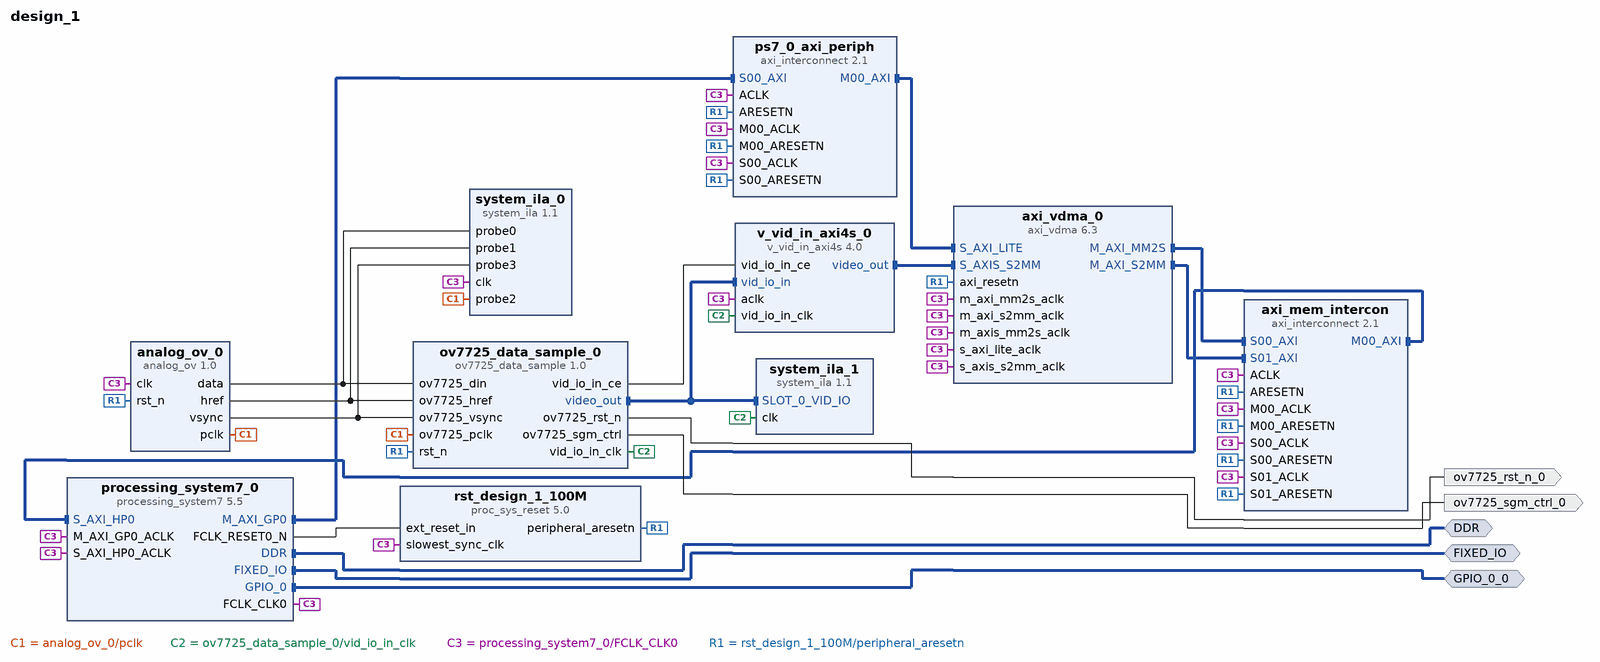
[diagram p0: block diagram of the top level]
# Vivado block design design_1, xc7z010clg400-1, Vivado 2021.1
create_bd_design design_1

create_bd_intf_port -mode Master -vlnv xilinx.com:interface:ddrx_rtl:1.0 DDR
create_bd_intf_port -mode Master -vlnv xilinx.com:display_processing_system7:fixedio_rtl:1.0 FIXED_IO
create_bd_intf_port -mode Master -vlnv xilinx.com:interface:gpio_rtl:1.0 GPIO_0_0
create_bd_port -dir O -type rst ov7725_rst_n_0
create_bd_port -dir O ov7725_sgm_ctrl_0

create_bd_cell -type ip -vlnv xilinx.com:ip:processing_system7:5.5 processing_system7_0
set_property -dict [list \
  CONFIG.PCW_FCLK_CLK0_BUF FALSE \
  CONFIG.PCW_FPGA0_PERIPHERAL_FREQMHZ 48 \
  CONFIG.PCW_GPIO_EMIO_GPIO_ENABLE 1 \
  CONFIG.PCW_GPIO_EMIO_GPIO_IO 8 \
  CONFIG.PCW_GPIO_EMIO_GPIO_WIDTH 8 \
  CONFIG.PCW_GPIO_MIO_GPIO_ENABLE 1 \
  CONFIG.PCW_GPIO_MIO_GPIO_IO MIO \
  CONFIG.PCW_I2C_RESET_ENABLE 1 \
  CONFIG.PCW_PRESET_BANK1_VOLTAGE {LVCMOS 1.8V} \
  CONFIG.PCW_UART1_PERIPHERAL_ENABLE 1 \
  CONFIG.PCW_UART1_UART1_IO {MIO 48 .. 49} \
  CONFIG.PCW_UART_PERIPHERAL_FREQMHZ 100 \
  CONFIG.PCW_UIPARAM_DDR_BUS_WIDTH {16 Bit} \
  CONFIG.PCW_UIPARAM_DDR_PARTNO {MT41J256M16 RE-125} \
  CONFIG.PCW_USB_RESET_ENABLE 1 \
  CONFIG.PCW_USE_S_AXI_HP0 1 \
] [get_bd_cells processing_system7_0]
# 196 more settings of processing_system7_0 are not shown: defaults, MIO pin electricals, DDR timing, and values the tool derives
create_bd_cell -type ip -vlnv xilinx.com:ip:v_vid_in_axi4s:4.0 v_vid_in_axi4s_0
set_property -dict {CONFIG.C_HAS_ASYNC_CLK 1} [get_bd_cells v_vid_in_axi4s_0]
create_bd_cell -type ip -vlnv xilinx.com:user:ov7725_data_sample:1.0 ov7725_data_sample_0
create_bd_cell -type ip -vlnv xilinx.com:ip:axi_vdma:6.3 axi_vdma_0
create_bd_cell -type ip -vlnv xilinx.com:ip:proc_sys_reset:5.0 rst_design_1_100M
create_bd_cell -type ip -vlnv xilinx.com:ip:axi_interconnect:2.1 ps7_0_axi_periph
set_property -dict {CONFIG.NUM_MI 1} [get_bd_cells ps7_0_axi_periph]
create_bd_cell -type ip -vlnv xilinx.com:ip:axi_interconnect:2.1 axi_mem_intercon
set_property -dict {CONFIG.NUM_MI 1 CONFIG.NUM_SI 2} [get_bd_cells axi_mem_intercon]
create_bd_cell -type ip -vlnv xilinx.com:user:analog_ov:1.0 analog_ov_0
create_bd_cell -type ip -vlnv xilinx.com:ip:system_ila:1.1 system_ila_0
set_property -dict [list \
  CONFIG.C_MON_TYPE NATIVE \
  CONFIG.C_NUM_OF_PROBES 4 \
  CONFIG.C_PROBE0_TYPE 0 \
  CONFIG.C_PROBE1_TYPE 0 \
  CONFIG.C_PROBE2_TYPE 0 \
  CONFIG.C_PROBE3_TYPE 0 \
] [get_bd_cells system_ila_0]
create_bd_cell -type ip -vlnv xilinx.com:ip:system_ila:1.1 system_ila_1
set_property -dict [list \
  CONFIG.C_MON_TYPE INTERFACE \
  CONFIG.C_NUM_MONITOR_SLOTS 1 \
  CONFIG.C_SLOT_0_INTF_TYPE xilinx.com:interface:vid_io_rtl:1.0 \
  CONFIG.C_SLOT_0_TYPE 0 \
] [get_bd_cells system_ila_1]

# ---- connections ----

connect_bd_intf_net [get_bd_intf_pins axi_mem_intercon/M00_AXI] [get_bd_intf_pins processing_system7_0/S_AXI_HP0]
connect_bd_intf_net [get_bd_intf_pins axi_vdma_0/M_AXI_MM2S] [get_bd_intf_pins axi_mem_intercon/S00_AXI]
connect_bd_intf_net [get_bd_intf_pins axi_vdma_0/M_AXI_S2MM] [get_bd_intf_pins axi_mem_intercon/S01_AXI]
connect_bd_intf_net -intf_net ov7725_data_sample_0_video_out [get_bd_intf_pins ov7725_data_sample_0/video_out] [get_bd_intf_pins v_vid_in_axi4s_0/vid_io_in]
connect_bd_intf_net [get_bd_intf_pins ov7725_data_sample_0/video_out] [get_bd_intf_pins system_ila_1/SLOT_0_VID_IO]
connect_bd_intf_net [get_bd_intf_ports DDR] [get_bd_intf_pins processing_system7_0/DDR]
connect_bd_intf_net [get_bd_intf_ports FIXED_IO] [get_bd_intf_pins processing_system7_0/FIXED_IO]
connect_bd_intf_net [get_bd_intf_ports GPIO_0_0] [get_bd_intf_pins processing_system7_0/GPIO_0]
connect_bd_intf_net [get_bd_intf_pins processing_system7_0/M_AXI_GP0] [get_bd_intf_pins ps7_0_axi_periph/S00_AXI]
connect_bd_intf_net [get_bd_intf_pins ps7_0_axi_periph/M00_AXI] [get_bd_intf_pins axi_vdma_0/S_AXI_LITE]
connect_bd_intf_net [get_bd_intf_pins v_vid_in_axi4s_0/video_out] [get_bd_intf_pins axi_vdma_0/S_AXIS_S2MM]
connect_bd_net -net analog_ov_0_data [get_bd_pins analog_ov_0/data] [get_bd_pins ov7725_data_sample_0/ov7725_din] [get_bd_pins system_ila_0/probe0]
connect_bd_net -net analog_ov_0_href [get_bd_pins analog_ov_0/href] [get_bd_pins ov7725_data_sample_0/ov7725_href] [get_bd_pins system_ila_0/probe1]
connect_bd_net -net analog_ov_0_pclk [get_bd_pins analog_ov_0/pclk] [get_bd_pins ov7725_data_sample_0/ov7725_pclk] [get_bd_pins system_ila_0/probe2]
connect_bd_net -net analog_ov_0_vsync [get_bd_pins analog_ov_0/vsync] \
  [get_bd_pins ov7725_data_sample_0/ov7725_vsync] [get_bd_pins system_ila_0/probe3]
connect_bd_net [get_bd_pins ov7725_data_sample_0/ov7725_rst_n] [get_bd_ports ov7725_rst_n_0]
connect_bd_net [get_bd_pins ov7725_data_sample_0/ov7725_sgm_ctrl] [get_bd_ports ov7725_sgm_ctrl_0]
connect_bd_net [get_bd_pins ov7725_data_sample_0/vid_io_in_ce] [get_bd_pins v_vid_in_axi4s_0/vid_io_in_ce]
connect_bd_net [get_bd_pins ov7725_data_sample_0/vid_io_in_clk] [get_bd_pins v_vid_in_axi4s_0/vid_io_in_clk] [get_bd_pins system_ila_1/clk]
connect_bd_net [get_bd_pins processing_system7_0/FCLK_CLK0] \
  [get_bd_pins analog_ov_0/clk] [get_bd_pins axi_mem_intercon/ACLK] [get_bd_pins axi_mem_intercon/M00_ACLK] \
  [get_bd_pins processing_system7_0/S_AXI_HP0_ACLK] [get_bd_pins axi_mem_intercon/S00_ACLK] \
  [get_bd_pins axi_vdma_0/m_axi_mm2s_aclk] [get_bd_pins axi_mem_intercon/S01_ACLK] [get_bd_pins axi_vdma_0/m_axi_s2mm_aclk] \
  [get_bd_pins axi_vdma_0/s_axi_lite_aclk] [get_bd_pins ps7_0_axi_periph/M00_ACLK] [get_bd_pins axi_vdma_0/s_axis_s2mm_aclk] \
  [get_bd_pins v_vid_in_axi4s_0/aclk] [get_bd_pins processing_system7_0/M_AXI_GP0_ACLK] \
  [get_bd_pins ps7_0_axi_periph/S00_ACLK] [get_bd_pins ps7_0_axi_periph/ACLK] \
  [get_bd_pins rst_design_1_100M/slowest_sync_clk] [get_bd_pins axi_vdma_0/m_axis_mm2s_aclk] [get_bd_pins system_ila_0/clk]
connect_bd_net [get_bd_pins processing_system7_0/FCLK_RESET0_N] [get_bd_pins rst_design_1_100M/ext_reset_in]
connect_bd_net [get_bd_pins rst_design_1_100M/peripheral_aresetn] \
  [get_bd_pins ps7_0_axi_periph/S00_ARESETN] [get_bd_pins axi_vdma_0/axi_resetn] [get_bd_pins ps7_0_axi_periph/M00_ARESETN] \
  [get_bd_pins ps7_0_axi_periph/ARESETN] [get_bd_pins axi_mem_intercon/S00_ARESETN] \
  [get_bd_pins axi_mem_intercon/M00_ARESETN] [get_bd_pins axi_mem_intercon/ARESETN] \
  [get_bd_pins axi_mem_intercon/S01_ARESETN] [get_bd_pins ov7725_data_sample_0/rst_n] [get_bd_pins analog_ov_0/rst_n]
set_property HDL_ATTRIBUTE.DEBUG true [get_bd_intf_nets ov7725_data_sample_0_video_out]
set_property HDL_ATTRIBUTE.MARK_DEBUG true [get_bd_intf_nets ov7725_data_sample_0_video_out]
set_property HDL_ATTRIBUTE.DEBUG true [get_bd_nets analog_ov_0_data]
set_property HDL_ATTRIBUTE.MARK_DEBUG true [get_bd_nets analog_ov_0_data]
set_property HDL_ATTRIBUTE.DEBUG true [get_bd_nets analog_ov_0_href]
set_property HDL_ATTRIBUTE.MARK_DEBUG true [get_bd_nets analog_ov_0_href]
set_property HDL_ATTRIBUTE.DEBUG true [get_bd_nets analog_ov_0_pclk]
set_property HDL_ATTRIBUTE.MARK_DEBUG true [get_bd_nets analog_ov_0_pclk]
set_property HDL_ATTRIBUTE.DEBUG true [get_bd_nets analog_ov_0_vsync]
set_property HDL_ATTRIBUTE.MARK_DEBUG true [get_bd_nets analog_ov_0_vsync]

# ---- address map ----
assign_bd_address -offset 0x00000000 -range 512M -target_address_space [get_bd_addr_spaces axi_vdma_0/Data_MM2S] [get_bd_addr_segs processing_system7_0/S_AXI_HP0/HP0_DDR_LOWOCM]
assign_bd_address -offset 0x00000000 -range 512M -target_address_space [get_bd_addr_spaces axi_vdma_0/Data_S2MM] [get_bd_addr_segs processing_system7_0/S_AXI_HP0/HP0_DDR_LOWOCM]
assign_bd_address -offset 0x43000000 -range 64K -target_address_space [get_bd_addr_spaces processing_system7_0/Data] [get_bd_addr_segs axi_vdma_0/S_AXI_LITE/Reg]

validate_bd_design
save_bd_design
